# Altium schematic sheet Current Sense.SchDoc
size C
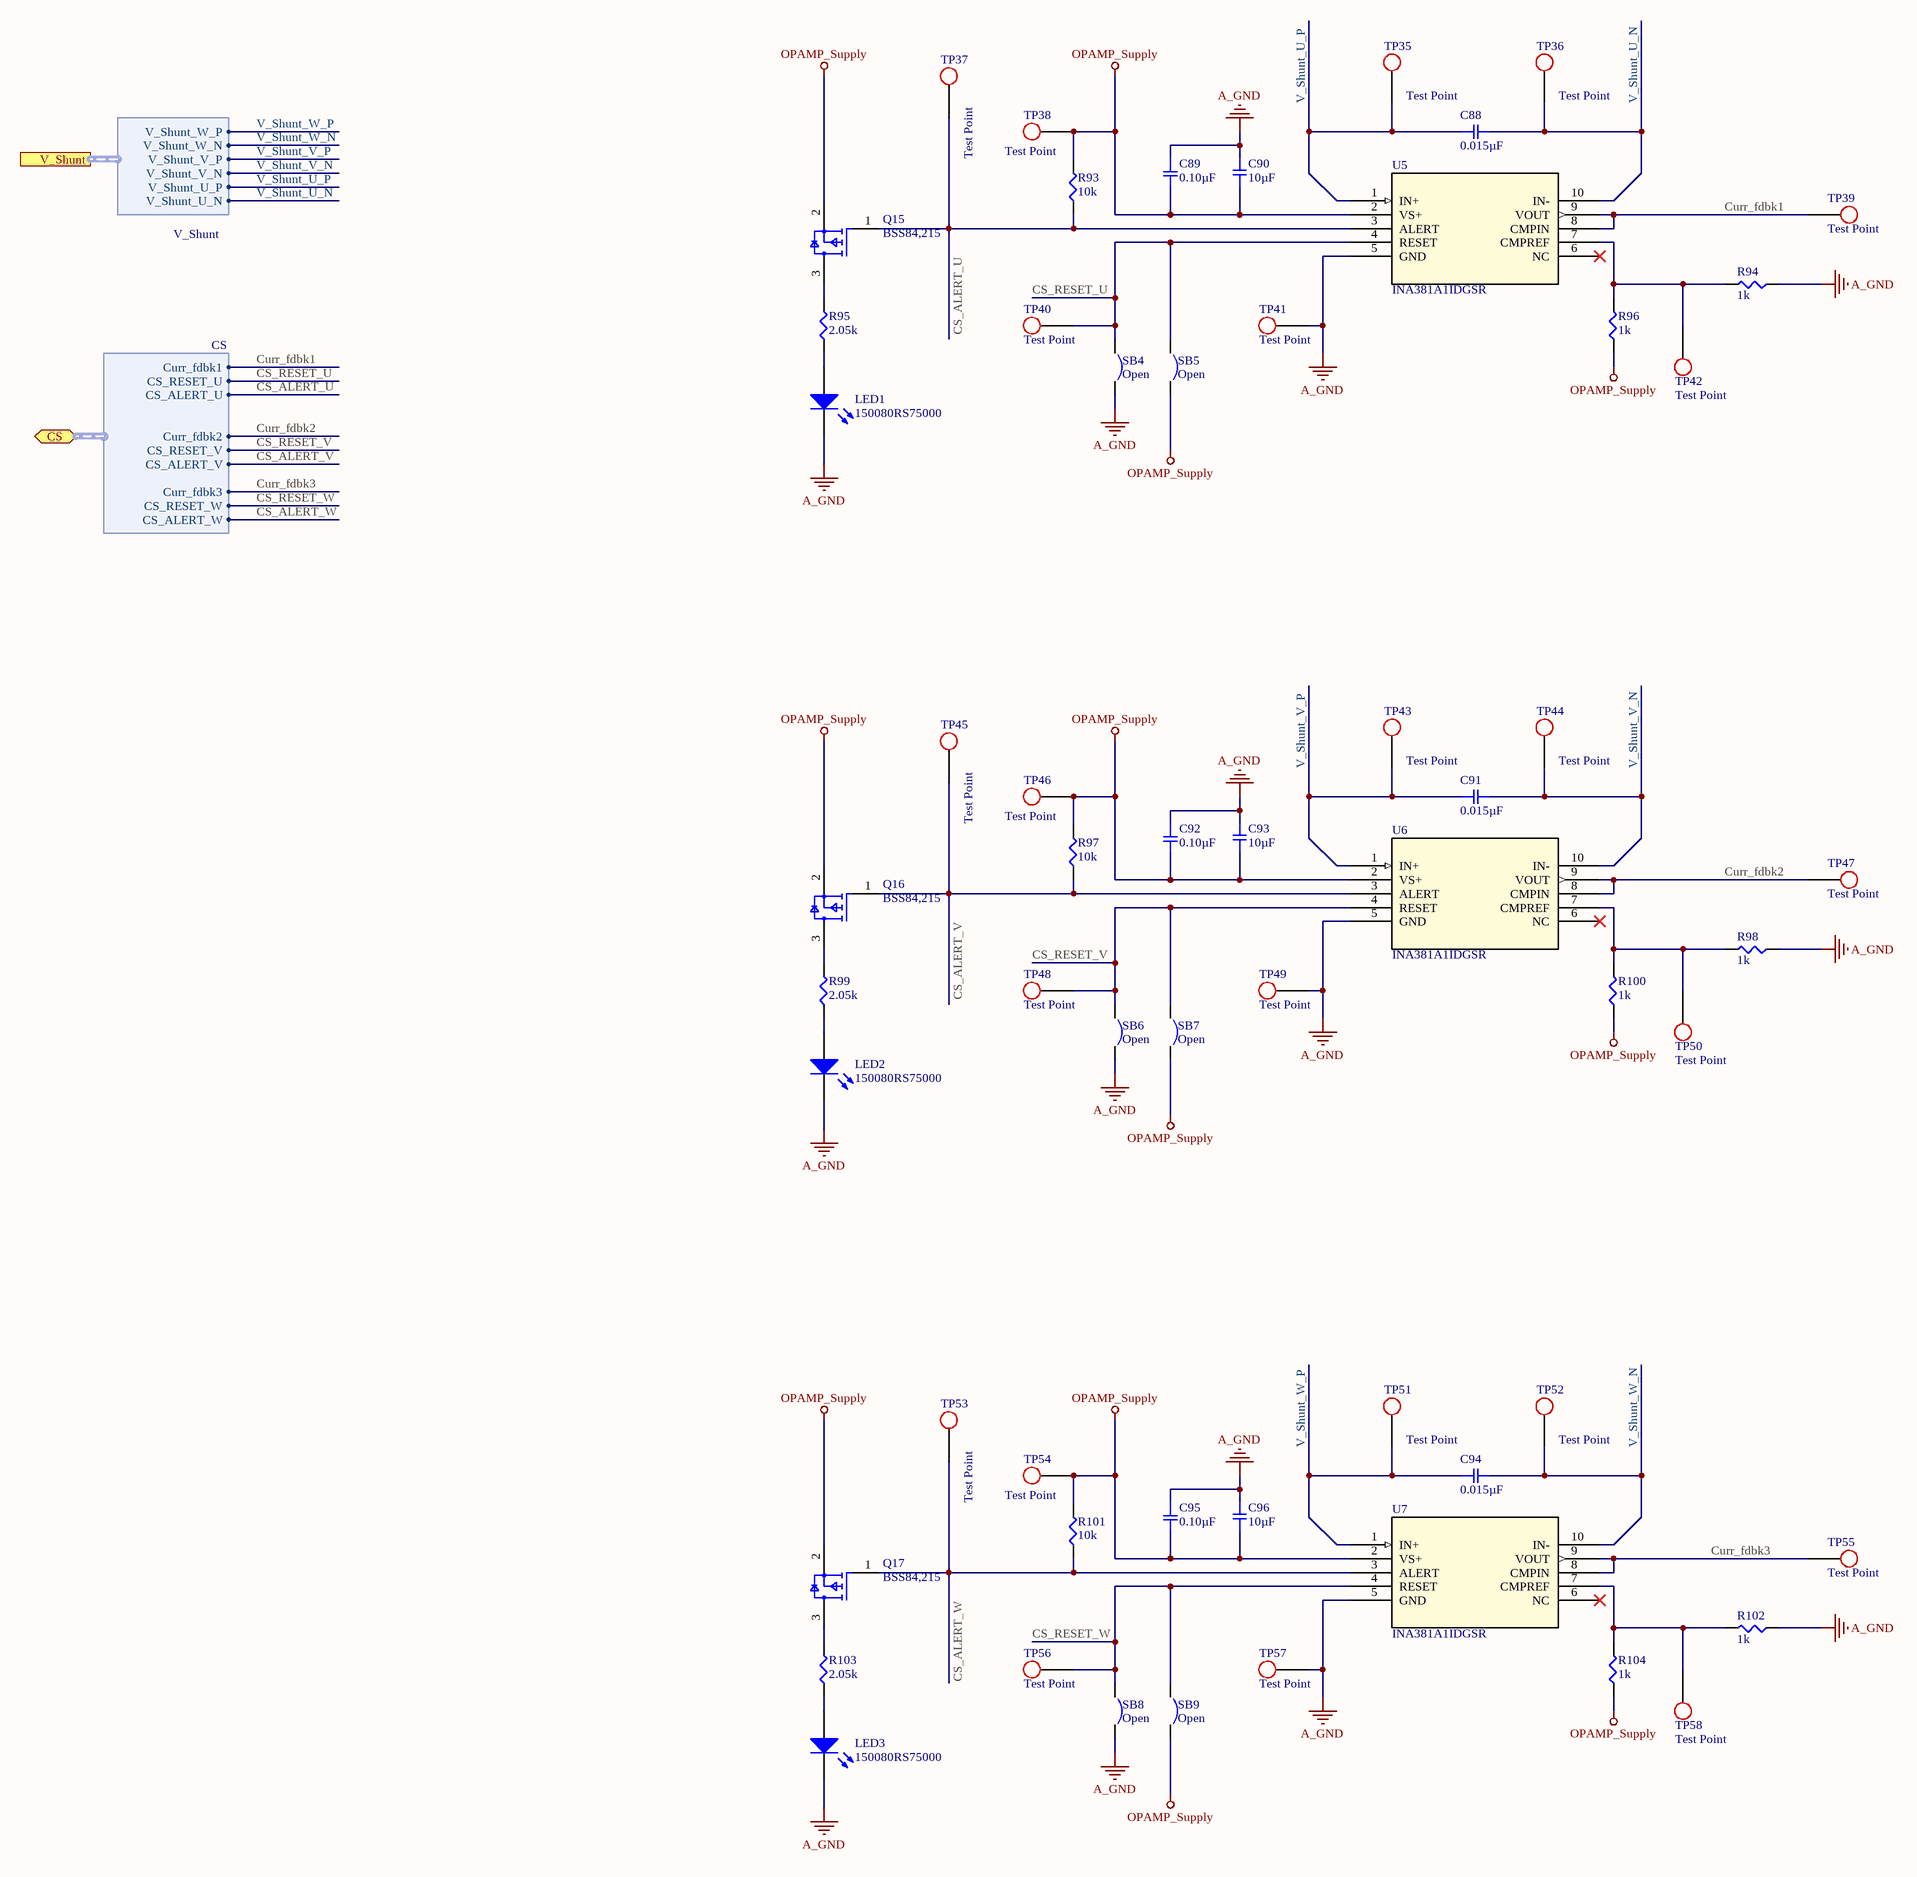
[diagram p0: Current Sense.SchDoc]

## Parts
C88  0.015µF  [SMD-0603C]
C89  0.10µF  [SMD-0805C]
C90  10µF  [SMD-1206C]
C91  0.015µF  [SMD-0603C]
C92  0.10µF  [SMD-0805C]
C93  10µF  [SMD-1206C]
C94  0.015µF  [SMD-0603C]
C95  0.10µF  [SMD-0805C]
C96  10µF  [SMD-1206C]
LED1  150080RS75000  [0805_A]
LED2  150080RS75000  [0805_A]
LED3  150080RS75000  [0805_A]
Q15  BSS84,215  [FP-SOT23-MFG]
Q16  BSS84,215  [FP-SOT23-MFG]
Q17  BSS84,215  [FP-SOT23-MFG]
R93  10k  [SMD-0603-RES]
R94  1k  [SMD-0603-RES]
R95  2.05k  [SMD-0603-RES]
R96  1k  [SMD-0603-RES]
R97  10k  [SMD-0603-RES]
R98  1k  [SMD-0603-RES]
R99  2.05k  [SMD-0603-RES]
R100  1k  [SMD-0603-RES]
R101  10k  [SMD-0603-RES]
R102  1k  [SMD-0603-RES]
R103  2.05k  [SMD-0603-RES]
R104  1k  [SMD-0603-RES]
SB4  Open  [SB_0603]  (no BOM)
SB5  Open  [SB_0603]  (no BOM)
SB6  Open  [SB_0603]  (no BOM)
SB7  Open  [SB_0603]  (no BOM)
SB8  Open  [SB_0603]  (no BOM)
SB9  Open  [SB_0603]  (no BOM)
TP35  Test Point  [Test_point_THT]  (no BOM)
TP36  Test Point  [Test_point_THT]  (no BOM)
TP37  Test Point  [Test_point_THT]  (no BOM)
TP38  Test Point  [Test_point_SMD]  (no BOM)
TP39  Test Point  [Test_point_THT]  (no BOM)
TP40  Test Point  [Test_point_SMD]  (no BOM)
TP41  Test Point  [Test_point_THT]  (no BOM)
TP42  Test Point  [Test_point_THT]  (no BOM)
TP43  Test Point  [Test_point_THT]  (no BOM)
TP44  Test Point  [Test_point_THT]  (no BOM)
TP45  Test Point  [Test_point_THT]  (no BOM)
TP46  Test Point  [Test_point_SMD]  (no BOM)
TP47  Test Point  [Test_point_THT]  (no BOM)
TP48  Test Point  [Test_point_SMD]  (no BOM)
TP49  Test Point  [Test_point_THT]  (no BOM)
TP50  Test Point  [Test_point_THT]  (no BOM)
TP51  Test Point  [Test_point_THT]  (no BOM)
TP52  Test Point  [Test_point_THT]  (no BOM)
TP53  Test Point  [Test_point_THT]  (no BOM)
TP54  Test Point  [Test_point_SMD]  (no BOM)
TP55  Test Point  [Test_point_THT]  (no BOM)
TP56  Test Point  [Test_point_SMD]  (no BOM)
TP57  Test Point  [Test_point_THT]  (no BOM)
TP58  Test Point  [Test_point_THT]  (no BOM)
U5  INA381A1IDGSR  [TSSOP50P490X110-10N]
U6  INA381A1IDGSR  [TSSOP50P490X110-10N]
U7  INA381A1IDGSR  [TSSOP50P490X110-10N]

## Ports
CS (bidir, harness CS), V_Shunt (harness V_Shunt)

## Harnesses
V_Shunt: V_Shunt_U_N, V_Shunt_U_P, V_Shunt_V_N, V_Shunt_V_P, V_Shunt_W_N, V_Shunt_W_P
CS: Curr_fdbk1, CS_RESET_U, CS_ALERT_U, Curr_fdbk2, CS_RESET_V, CS_ALERT_V, Curr_fdbk3, CS_RESET_W, CS_ALERT_W

## Nets
A_GND: C89.1 C90.2 C92.1 C93.2 C95.1 C96.2 LED1.1(K) LED2.1(K) LED3.1(K) R94.1 R98.1 R102.1 SB4.1 SB6.1 SB8.1 TP41.1 TP49.1 TP57.1 U5.5(GND) U6.5(GND) U7.5(GND)
OPAMP_Supply: C89.2 C90.1 C92.2 C93.1 C95.2 C96.1 Q15.2(S) Q16.2(S) Q17.2(S) R93.2 R96.1 R97.2 R100.1 R101.2 R104.1 SB5.1 SB7.1 SB9.1 TP38.1 TP46.1 TP54.1 U5.2(VS+) U6.2(VS+) U7.2(VS+)
CS_ALERT_U: Q15.1(G) R93.1 TP37.1 U5.3(ALERT) ; port CS.CS_ALERT_U
CS_ALERT_V: Q16.1(G) R97.1 TP45.1 U6.3(ALERT) ; port CS.CS_ALERT_V
CS_ALERT_W: Q17.1(G) R101.1 TP53.1 U7.3(ALERT) ; port CS.CS_ALERT_W
CS_RESET_U: SB4.2 SB5.2 TP40.1 U5.4(RESET) ; port CS.CS_RESET_U
CS_RESET_V: SB6.2 SB7.2 TP48.1 U6.4(RESET) ; port CS.CS_RESET_V
CS_RESET_W: SB8.2 SB9.2 TP56.1 U7.4(RESET) ; port CS.CS_RESET_W
Curr_fdbk1: TP39.1 U5.8(CMPIN) U5.9(VOUT) ; port CS.Curr_fdbk1
Curr_fdbk2: TP47.1 U6.8(CMPIN) U6.9(VOUT) ; port CS.Curr_fdbk2
Curr_fdbk3: TP55.1 U7.8(CMPIN) U7.9(VOUT) ; port CS.Curr_fdbk3
V_Shunt_U_N: C88.2 TP36.1 U5.10(IN-) ; port V_Shunt.V_Shunt_U_N
V_Shunt_U_P: C88.1 TP35.1 U5.1(IN+) ; port V_Shunt.V_Shunt_U_P
V_Shunt_V_N: C91.2 TP44.1 U6.10(IN-) ; port V_Shunt.V_Shunt_V_N
V_Shunt_V_P: C91.1 TP43.1 U6.1(IN+) ; port V_Shunt.V_Shunt_V_P
V_Shunt_W_N: C94.2 TP52.1 U7.10(IN-) ; port V_Shunt.V_Shunt_W_N
V_Shunt_W_P: C94.1 TP51.1 U7.1(IN+) ; port V_Shunt.V_Shunt_W_P
NetLED1_2: LED1.2(A) R95.1
NetLED2_2: LED2.2(A) R99.1
NetLED3_2: LED3.2(A) R103.1
NetQ15_3: Q15.3(D) R95.2
NetQ16_3: Q16.3(D) R99.2
NetQ17_3: Q17.3(D) R103.2
NetR94_2: R94.2 R96.2 TP42.1 U5.7(CMPREF)
NetR98_2: R98.2 R100.2 TP50.1 U6.7(CMPREF)
NetR102_2: R102.2 R104.2 TP58.1 U7.7(CMPREF)

Not connected (* = marked no-connect by the designer): U5 6(NC)*; U6 6(NC)*; U7 6(NC)*

## Library data of the parts
C88 C91 C94 = GCJ188R72A153KA01D: CAP CER 0.015UF 100V X7R 0603; Manufacturer: Murata Electronics North America; Factory Stock: 0; Unit Price (USD): 0.26; Minimum Quantity: 1; Tolerance: ±10%; Datasheets: http://www.murata.com/~/media/webrenewal/support/library/catalog/products/capacitor/mlcc/c03e.ashx; Image: //media.digikey.com/Renders/Murata%20Renders/0603%28LQG18%29.jpg; Digi-Key Part Number: 490-5770-1-ND; Part Number: GCJ188R72A153KA01D; Quantity Available: 450; @ qty: 0; Packaging: Cut Tape (CT); Series: GCJ; Part Status: Active; Value: 0.015µF; Voltage: 100V; Temperature Coefficient: X7R; Operating Temperature: -55°C ~ 125°C; Features: Soft Termination; Ratings: AEC-Q200; Applications: Automotive, Boardflex Sensitive; Mounting Type: Surface Mount, MLCC; Package / Case: 0603 (1608 Metric); Size / Dimension: 0.063" L x 0.031" W (1.60mm x 0.80mm); Height - Seated (Max): -; Thickness (Max): 0.031" (0.80mm); Lead Spacing: -; Lead Style: -
C89 C92 C95 = GCM21BR71H104KA37K: CAP CER 0.1UF 50V X7R 0805; Manufacturer: Murata Electronics North America; Factory Stock: 0; Unit Price (USD): 0.12; Minimum Quantity: 1; Tolerance: ±10%; Datasheets: http://www.murata.com/~/media/webrenewal/support/library/catalog/products/capacitor/mlcc/c03e.ashx; Image: //media.digikey.com/photos/Murata%20Photos/NCP,GCM%20SERIES%200805.jpg; Digi-Key Part Number: 490-8049-1-ND; Part Number: GCM21BR71H104KA37K; Quantity Available: 322; @ qty: 0; Packaging: Cut Tape (CT); Series: GCM; Part Status: Active; Value: 0.10µF; Voltage: 50V; Temperature Coefficient: X7R; Operating Temperature: -55°C ~ 125°C; Features: -; Ratings: AEC-Q200; Applications: Automotive; Mounting Type: Surface Mount, MLCC; Package / Case: 0805 (2012 Metric); Size / Dimension: 0.079" L x 0.049" W (2.00mm x 1.25mm); Height - Seated (Max): -; Thickness (Max): 0.055" (1.40mm); Lead Spacing: -; Lead Style: -
C90 C93 C96 = GRJ31CR71E106KE11L: CAP CER 10UF 25V X7R 1206; Manufacturer: Murata Electronics North America; Factory Stock: 0; Unit Price (USD): 0.69; Minimum Quantity: 1; Tolerance: ±10%; Datasheets: http://www.murata.com/~/media/webrenewal/support/library/catalog/products/capacitor/mlcc/c02e.pdf; Image: //media.digikey.com/Renders/Murata%20Renders/GR331BD72E473KW01L.jpg; Digi-Key Part Number: 490-10940-1-ND; Part Number: GRJ31CR71E106KE11L; Quantity Available: 1598; @ qty: 0; Packaging: Cut Tape (CT); Series: GRJ; Part Status: Active; Value: 10µF; Voltage: 25V; Temperature Coefficient: X7R; Operating Temperature: -55°C ~ 125°C; Features: Soft Termination; Ratings: -; Applications: Boardflex Sensitive; Mounting Type: Surface Mount, MLCC; Package / Case: 1206 (3216 Metric); Size / Dimension: 0.126" L x 0.063" W (3.20mm x 1.60mm); Height - Seated (Max): -; Thickness (Max): 0.075" (1.90mm); Lead Spacing: -; Lead Style: -
LED1-LED3 = 150080RS75000: SMD mono-color Chip LED, WL-SMCW, Red; PackageReference: 0805_A; Color: Red; PartNumber: 150080RS75000; ComponentLink1Description: Manufacturer URL; ComponentLink1URL: http://www.we-online.com; ComponentLink2Description: Datasheet; ComponentLink2URL: http://katalog.we-online.com/led/datasheet/150080RS75000.pdf
Q15-Q17 = CMP-14409-000006-1: MOSFET P-CH 50V 130MA SOT-23; Manufacturer: Nexperia USA Inc.; Drain To Source Breakdown Voltage: -50V; Description: P-Channel 50V 130mA (Ta) 250mW (Tc) Surface Mount TO-236AB; Max Junction Temp: +150°C; Threshold Vgs Min: -0.8V; Turn On Delay Time: 3ns; Power Dissipation: 250mW; Turn Off Delay Time: 7ns; Gate To Source Voltage: 20V; Number Of Channels: 1; Input Capacitace At Vds: 25pF @ -25V; Threshold Vgs Max: -2V; Continuous Drain Current: -130mA; Depletion Mode: False; Drain To Source Resistance: 6Ω; Rthja Max: 500K/W; Octopart: https://octopart.com/bss84%2C215-nexperia-78739375; Ipc Land Pattern Name: SOT95P230X100-3; Drain To Source Voltage: -50V; Lead Free: Yes; Temperature Range High: +150°C; Automotive: No; Device Class L2: Transistors; Manufacturer Part Number: BSS84,215; Package: SOT23; ComponentLink2URL: https://assets.nexperia.com/documents/data-sheet/BSS84.pdf; Category: Trans; RoHS: TRUE; Temperature Range Low: -65°C; ComponentLink2Description: Datasheet; Device Class L1: Discrete Semiconductors; Number Of P Channels: 1; Device Class L3: MOSFETs; Height: 1.1mm; Digikey Description: MOSFET P-CH 50V 130MA SOT-23; Temperature: -65°C to +150°C; Footprint Url: https://assets.nexperia.com/documents/outline-drawing/SOT23.pdf
R93 R97 R101 = ERJ-3EKF1002V: RES SMD 10K OHM 1% 1/10W 0603; Manufacturer: Panasonic Electronic Components; Factory Stock: 0; Unit Price (USD): 0.00379; @ qty: 1500; Minimum Quantity: 1; Power (Watts): 0.1W, 1/10W; Temperature Coefficient: ±100ppm/°C; Part Number: ERJ-3EKF1002V; Datasheets: http://industrial.panasonic.com/www-cgi/jvcr13pz.cgi?E+PZ+3+AOA0002+ERJ3EKF1002V+7+WW; Image: //media.digikey.com/Photos/Panasonic%20Photos/MFG_ERJ-P6W%20Series.jpg; Digi-Key Part Number: P10.0KHCT-ND; Quantity Available: 6703141; Packaging: Cut Tape (CT); Series: ERJ; Part Status: Active; Value: 10k; Tolerance: ±1%; Composition: Thick Film; Features: Automotive AEC-Q200; Operating Temperature: -55°C ~ 155°C; Package / Case: 0603 (1608 Metric); Supplier Device Package: 0603; Size / Dimension: 0.063" L x 0.031" W (1.60mm x 0.80mm); Height - Seated (Max): 0.022" (0.55mm); Number of Terminations: 2; Failure Rate: -
R94 R96 R98 R100 R102 R104 = ERJ-3EKF1001V: RES SMD 1K OHM 1% 1/10W 0603; Manufacturer: Panasonic Electronic Components; Factory Stock: 0; Unit Price (USD): 0.00379; @ qty: 1500; Minimum Quantity: 1; Power (Watts): 0.1W, 1/10W; Temperature Coefficient: ±100ppm/°C; Part Number: ERJ-3EKF1001V; Datasheets: http://industrial.panasonic.com/www-cgi/jvcr13pz.cgi?E+PZ+3+AOA0002+ERJ3EKF1001V+7+WW; Image: //media.digikey.com/Photos/Panasonic%20Photos/MFG_ERJ-P6W%20Series.jpg; Digi-Key Part Number: P1.00KHCT-ND; Quantity Available: 5218845; Packaging: Cut Tape (CT); Series: ERJ; Part Status: Active; Value: 1k; Tolerance: ±1%; Composition: Thick Film; Features: Automotive AEC-Q200; Operating Temperature: -55°C ~ 155°C; Package / Case: 0603 (1608 Metric); Supplier Device Package: 0603; Size / Dimension: 0.063" L x 0.031" W (1.60mm x 0.80mm); Height - Seated (Max): 0.022" (0.55mm); Number of Terminations: 2; Failure Rate: -
R95 R99 R103 = ERJ-3EKF2051V: RES SMD 2.05K OHM 1% 1/10W 0603; Manufacturer: Panasonic Electronic Components; Factory Stock: 0; Unit Price (USD): 0.00379; @ qty: 1500; Minimum Quantity: 1; Power (Watts): 0.1W, 1/10W; Temperature Coefficient: ±100ppm/°C; Part Number: ERJ-3EKF2051V; Datasheets: http://industrial.panasonic.com/www-cgi/jvcr13pz.cgi?E+PZ+3+AOA0002+ERJ3EKF2051V+7+WW; Image: //media.digikey.com/Photos/Panasonic%20Photos/MFG_ERJ-P6W%20Series.jpg; Digi-Key Part Number: P2.05KHCT-ND; Quantity Available: 48175; Packaging: Cut Tape (CT); Series: ERJ; Part Status: Active; Value: 2.05k; Tolerance: ±1%; Composition: Thick Film; Features: Automotive AEC-Q200; Operating Temperature: -55°C ~ 155°C; Package / Case: 0603 (1608 Metric); Supplier Device Package: 0603; Size / Dimension: 0.063" L x 0.031" W (1.60mm x 0.80mm); Height - Seated (Max): 0.022" (0.55mm); Number of Terminations: 2; Failure Rate: -
SB4-SB9 = Solder Bridge: Circuit Breaker; Published: 24-Mar-1999; Revision: July-2002: Re-released for DXP Platform.; Publisher: Altium Limited
U5-U7 = INA381A1IDGSR: No Description Available; SourceLibrary: Texas_Instruments_2020-07-20; Built_By: EMA_Matt; Vendor: Texas Instruments; Datasheet: https://www.ti.com/lit/ds/symlink/ina381.pdf?ts=1595282869145&ref_url=https%253A%252F%252Fwww.ti.com%252Fstore%252Fti%252Fen%252Fp%252Fproduct%252F%253Fp%253DINA381A1IDGSR; Copyright: Copyright (C) 2018 Accelerated Designs. All rights reserved; Manufacturer_Part_Number: INA381A1IDGSR; RefDes: RefDes; Type: DEV